# Altium project Coral Dev Board Micro.PrjPcb (part 4 of 5)

## Sheet 13 USB.SchDoc: Coral 6 Layer Template With Controlled Impedances
size A2; ApprovedBy: DNP; CheckedBy: DNP; Author: DNP; CompanyName: Google LLC; DrawnBy: DNP; Engineer: Stefan; Organization: Google LLC; Address1: 1600 Amphitheatre Parkway; Address2: Mountain View, CA 94043; Address3: DNP; Address4: DNP; DocumentNumber: 13; Revision: PVT; SheetNumber: 13; SheetTotal: 17; VersionControl_RevNumber: DNP; IsUserConfigurable: DNP; Time: DNP; ImagePath: DNP; Rule: DNP; ProjectName: Enterprise; Application_BuildNumber: DNP
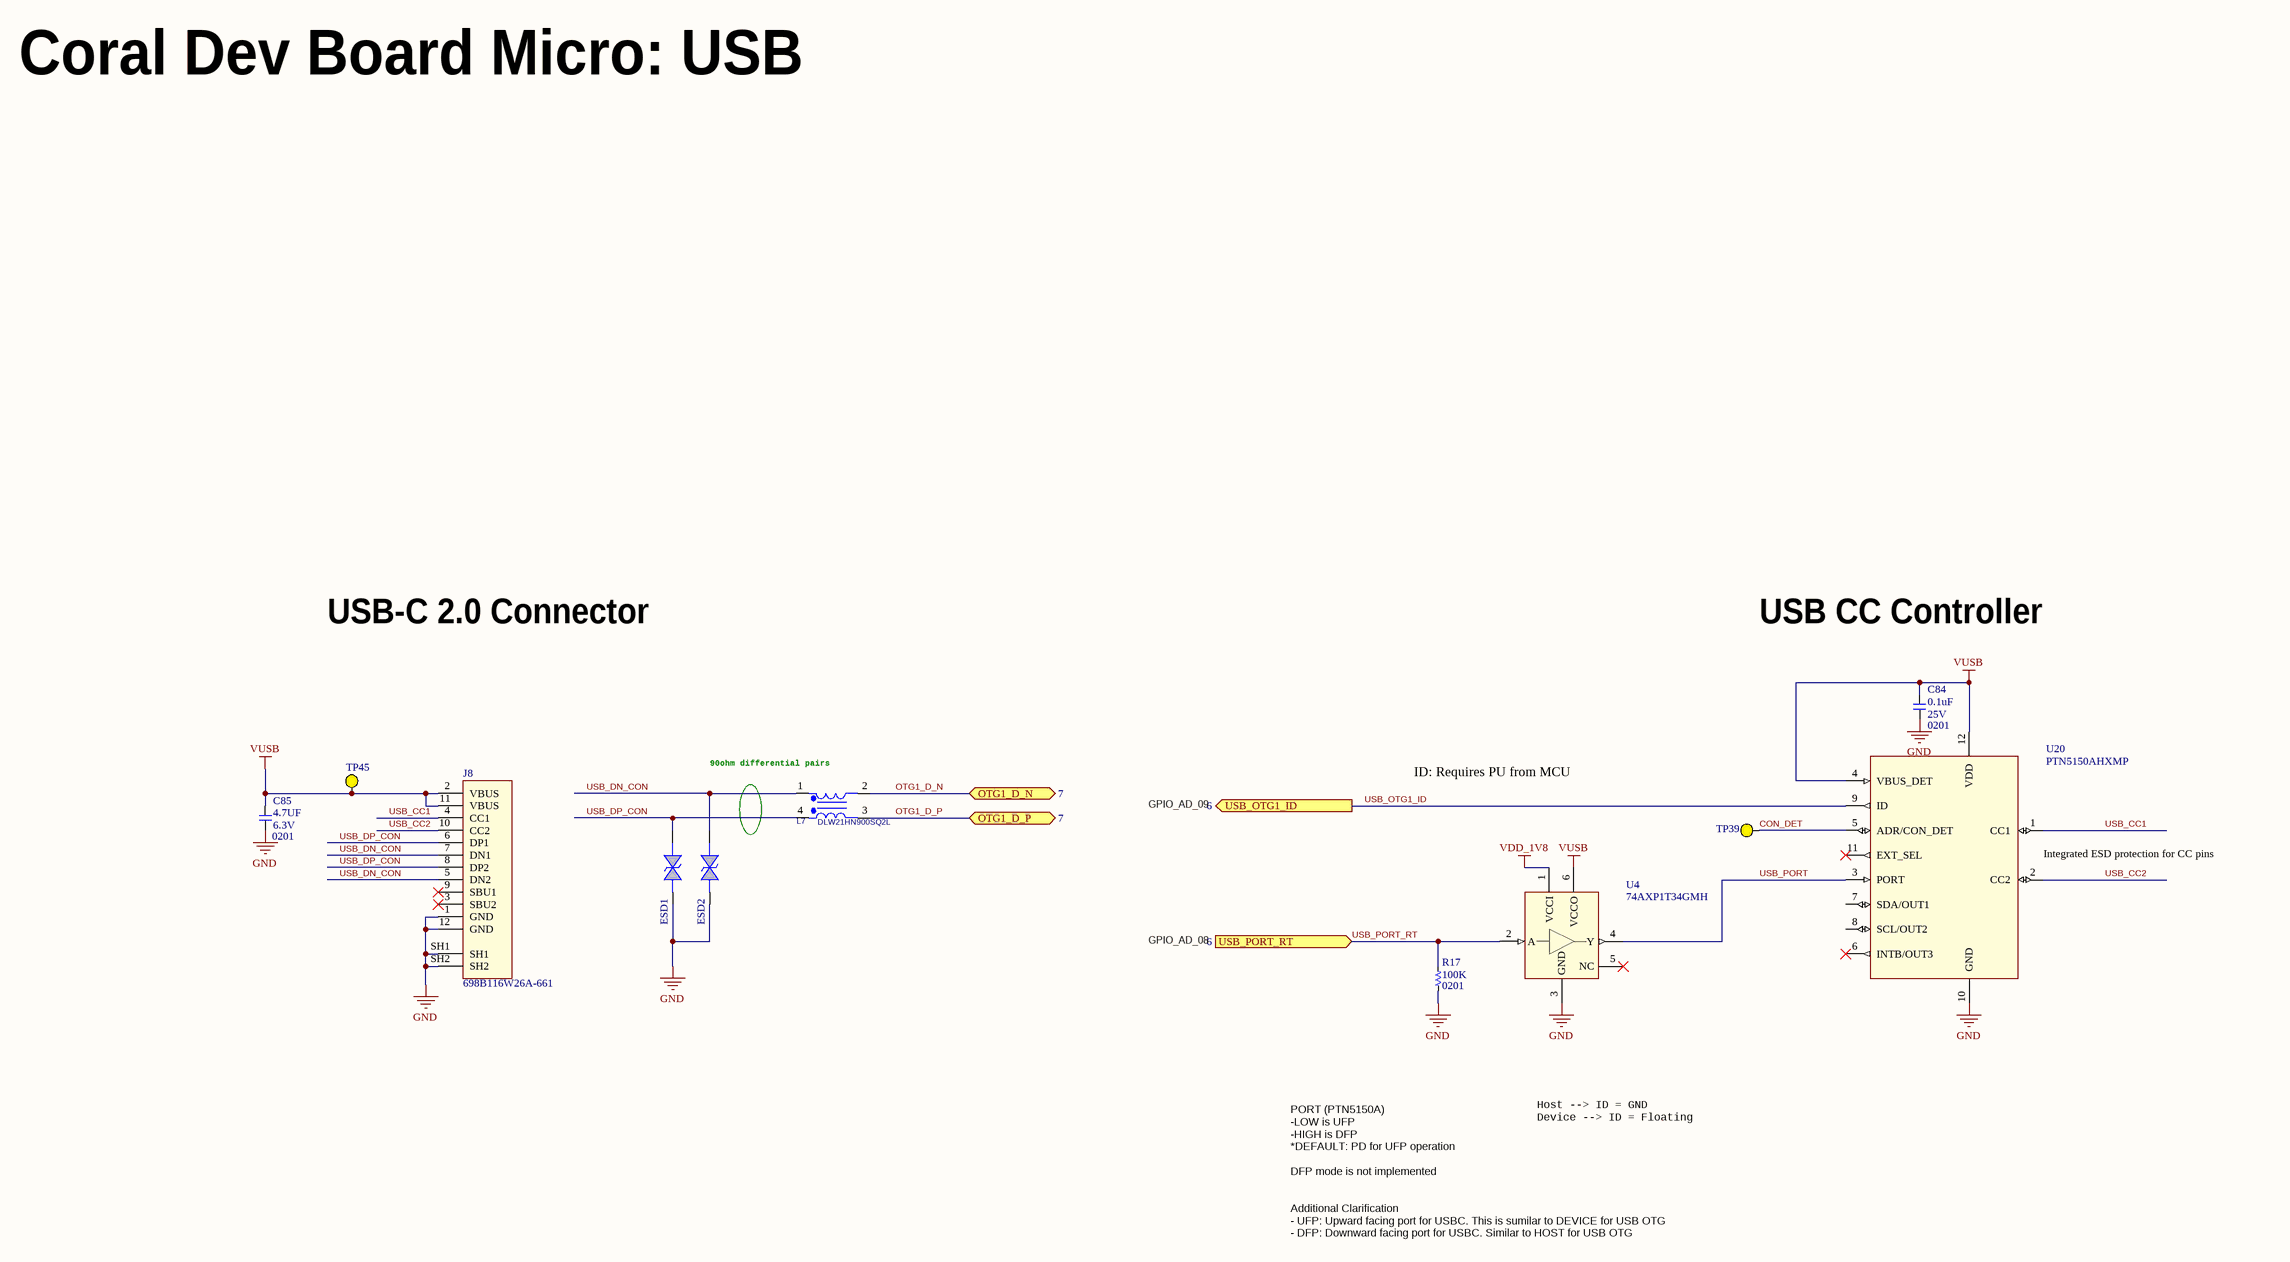
[diagram p18: 13 USB.SchDoc]

### Parts
C84  value 0.1uF  Package: 0201  Voltage: 25V  [C0201Y]  (hidden comment: __Template_Cap)
C85  value 4.7UF  Package: 0201  Voltage: 6.3V  [C0201Y]  (hidden comment: __Template_Cap)
ESD1  3.5pF/5V  [0201]  (value not drawn)
ESD2  3.5pF/5V  [0201]  (value not drawn)
J8  MFG P/N: 698B116W26A-661  [EDAC_698B116W26A-661]
L7  DLW21HN900SQ2L  [IND4_CHOKE_0805]
R17  value 100K  Package: 0201  [R0201]
TP39  TESTPAD_30MIL  [TESTPAD_SMT_30MIL]  (value not drawn)  (no BOM)
TP45  TESTPAD_30MIL  [TESTPAD_SMT_30MIL]  (value not drawn)  (no BOM)
U4  MFG P/N: 74AXP1T34GMH  [SON50P145X100X50-6]  (hidden comment: TRANSLATOR_74AXP1T34GMH)
U20  MFG P/N: PTN5150AHXMP  [X2QFN12_1.6X1.6MMM]  (hidden comment: CONTROLLER_PTN5150AHXMP)

### Ports
OTG1_D_N (bidir, see 7), OTG1_D_P (bidir, see 7), USB_OTG1_ID (out, see 6), USB_PORT_RT (in, see 6)

### Nets
GND: C84.2 C85.2 ESD1.1 ESD2.1 J8.1(GND) J8.12(GND) J8.SH1 J8.SH2 R17.1 U4.3(GND) U20.10(GND)
VDD_1V8: U4.1(VCCI)
VUSB: C84.1 C85.1 J8.2(VBUS) J8.11(VBUS) TP45.1 U4.6(VCCO) U20.4(VBUS_DET) U20.12(VDD)
CON_DET: TP39.1 U20.5(ADR/CON_DET)
OTG1_D_N: L7.2 ; port OTG1_D_N
OTG1_D_P: L7.3 ; port OTG1_D_P
USB_CC1: J8.4(CC1) U20.1(CC1)
USB_CC2: J8.10(CC2) U20.2(CC2)
USB_DN_CON: ESD2.2 J8.5(DN2) J8.7(DN1) L7.1
USB_DP_CON: ESD1.2 J8.6(DP1) J8.8(DP2) L7.4
USB_OTG1_ID: U20.9(ID) ; port USB_OTG1_ID
USB_PORT: U4.4(Y) U20.3(PORT)
USB_PORT_RT: R17.2 U4.2(A) ; port USB_PORT_RT

Not connected (* = marked no-connect by the designer): J8 3(SBU2)* 9(SBU1)*; U4 5(NC)*; U20 6(INTB/OUT3)* 7(SDA/OUT1) 8(SCL/OUT2) 11(EXT_SEL)*

### Notes on the sheet
- Coral Dev Board Micro: USB
- USB-C 2.0 Connector
- USB CC Controller
- (near L7) 90ohm differential pairs
- ID: Requires PU from MCU
- GPIO_AD_09
- (near U20) Integrated ESD protection for CC pins
- GPIO_AD_08
- Host --> ID = GND
  Device --> ID = Floating
- PORT (PTN5150A)
  -LOW is UFP
  -HIGH is DFP
  *DEFAULT: PD for UFP operation
  DFP mode is not implemented
- Additional Clarification
  - UFP: Upward facing port for USBC. This is sumilar to DEVICE for USB OTG
  - DFP: Downward facing port for USBC. Similar to HOST for USB OTG
- Project:
- Engineer:
- Date:
- File:
- Revision:
- Sheet
- of

### Library data of the parts
C84 = 386: as C19 on sheet 08 B2B; Status: Released; Dielectric: X5R; Tolerance: 20%; Height: 0.33mm T; ComponentLink1Description: Datasheet; COMMON: 150-01204-00; LOON: 150-01204-00; Gecko: 150-01204-00
C85 = 1199: as C235 on sheet 07 MIMXRT1170 PART3; Status: Released; Dielectric: X5R; Tolerance: 20%; Height: 0.33mm T; ComponentLink1Description: Datasheet; COMMON: 150-01224-00; LOON: 150-01224-00; Gecko: 150-01224-00
ESD1 ESD2 = DIODE BI-DIR TRIG: DIODE TVS 15kV 10V 50A 8pF SMT RoHS; MPN: DESD5V0V1BCSP-7; QPN: BC5V0V1BZ02; QPN Description: DIODE ESD SMD DESD5V0V1BCSP-7 6V,DSN0603; Function Code: USB; QCI MPN: DESD5V0V1BCSP-7; QCI Supplier: DDS
J8 = 1283: CONN, USB-C, RCPT, RA, USB 2.0, 16 P, 0.5MM PITCH, GOLD, SMT; ID: 1283; MFG: EDAC Inc; Number of Positions: 12; Current Rating: 3A; Voltage, Rated: 100VAC; Sub Assy Qty 2: 0; Status: Released; RoHS Compliant: Yes; Mounting Type: Surface Mount; Orientation: Right Angle; Number of Rows: 1; Operating Temperature: -30°C ~ 85°C; ComponentLink1Description: Datasheet; ComponentLink1URL: https://drive.google.com/corp/drive/folders/1cT-VNuTRhR0OJylJtjEkdbP9sP_ssI5q; Height: 2.71mm; Sub Assy Qty 3: 0; Sub Assy Qty 4: 0
L7 = IND_CMC_DLW21: IND CHK 90 OHM@100MHZ 330MA 25% 0805; QPN: CX1HN900000; QPN Description: EMI FILTER DLW21HN900SQ2L(90,330MA); Function Code: DBG; Supplier 1: Digi-Key; Supplier Part Number 1: 490-1064-1-ND; MPN: DLW21HN900SQ2L; QCI MPN: DLW21HN900SQ2L; QCI Supplier: MUR
R17 = 7818: RES, 100K, 1%, 1/20W, 0201; ID: 7818; MFG: PANASONIC; MFG P/N: ERJ1GEF1003C; COMMON: 470-00506-00; Status: NRND; Power: 1/20W; Tolerance: 1%; LOON: 470-00506-00; Gecko: 470-00506-00; XPN: 470-00506-00
TP39 TP45 = 178: as TP25 on sheet 07 MIMXRT1170 PART3; Status: Released; ComponentLink1URL: _PCB Feature
U4 = 441: IC, TRANSLATOR, 74AXP1, UNIDIR, 1-CH, NON-INVERTED O/P, LOW NOISE OVERSHOOT, XSON-6; ID: 441; MFG: Nexperia USA Inc.; Status: Released; Package: 6-XSON, SOT886 (1.45x1); Category: Integrated Circuits (ICs); RoHS Compliant: Yes; Supplier 1: Digi-Key; ComponentLink1Description: Datasheet; ComponentLink1URL: https://assets.nexperia.com/documents/data-sheet/74AXP1T34.pdf; Mounting Type: SMD; Height: 0.5mm; Supplier Part Number 1: 1727-2482-2-ND; HelpURL: https://www.digikey.com/en/products/detail/nexperia-usa-inc/74AXP1T34GMH/5971133?s=N4IgTCBcDaIOwBYCCANACgRgCoGYEHEBZACRAF0BfIA
U20 = 224: IC, HOST CTLR, PTN5150A, USB, 2.7 TO 5.5 VIN, X2QFN-12; ID: 224; MFG: NXP USA Inc.; Status: Released; Package: 12-X2QFN (1.6x1.6); RoHS Compliant: YES; Supplier 1: Digi-Key; HelpURL: https://www.digikey.in/product-detail/en/nxp-usa-inc/PTN5150AHXMP/568-13083-1-ND/6569882; ComponentLink1Description: Datasheet; ComponentLink1URL: https://www.nxp.com/docs/en/data-sheet/PTN5150A.pdf; Mounting Type: SMD; Supplier Part Number 1: 568-13083-1-ND

## Sheet 14 TPU.SchDoc: Coral 6 Layer Template With Controlled Impedances
size A2; ApprovedBy: DNP; CheckedBy: DNP; Author: DNP; CompanyName: Google LLC; DrawnBy: DNP; Engineer: Stefan; Organization: Google LLC; Address1: 1600 Amphitheatre Parkway; Address2: Mountain View, CA 94043; Address3: DNP; Address4: DNP; DocumentNumber: 14; Revision: PVT; SheetNumber: 14; SheetTotal: 17; VersionControl_RevNumber: DNP; IsUserConfigurable: DNP; Time: DNP; ImagePath: DNP; Rule: DNP; ProjectName: Enterprise; Application_BuildNumber: DNP
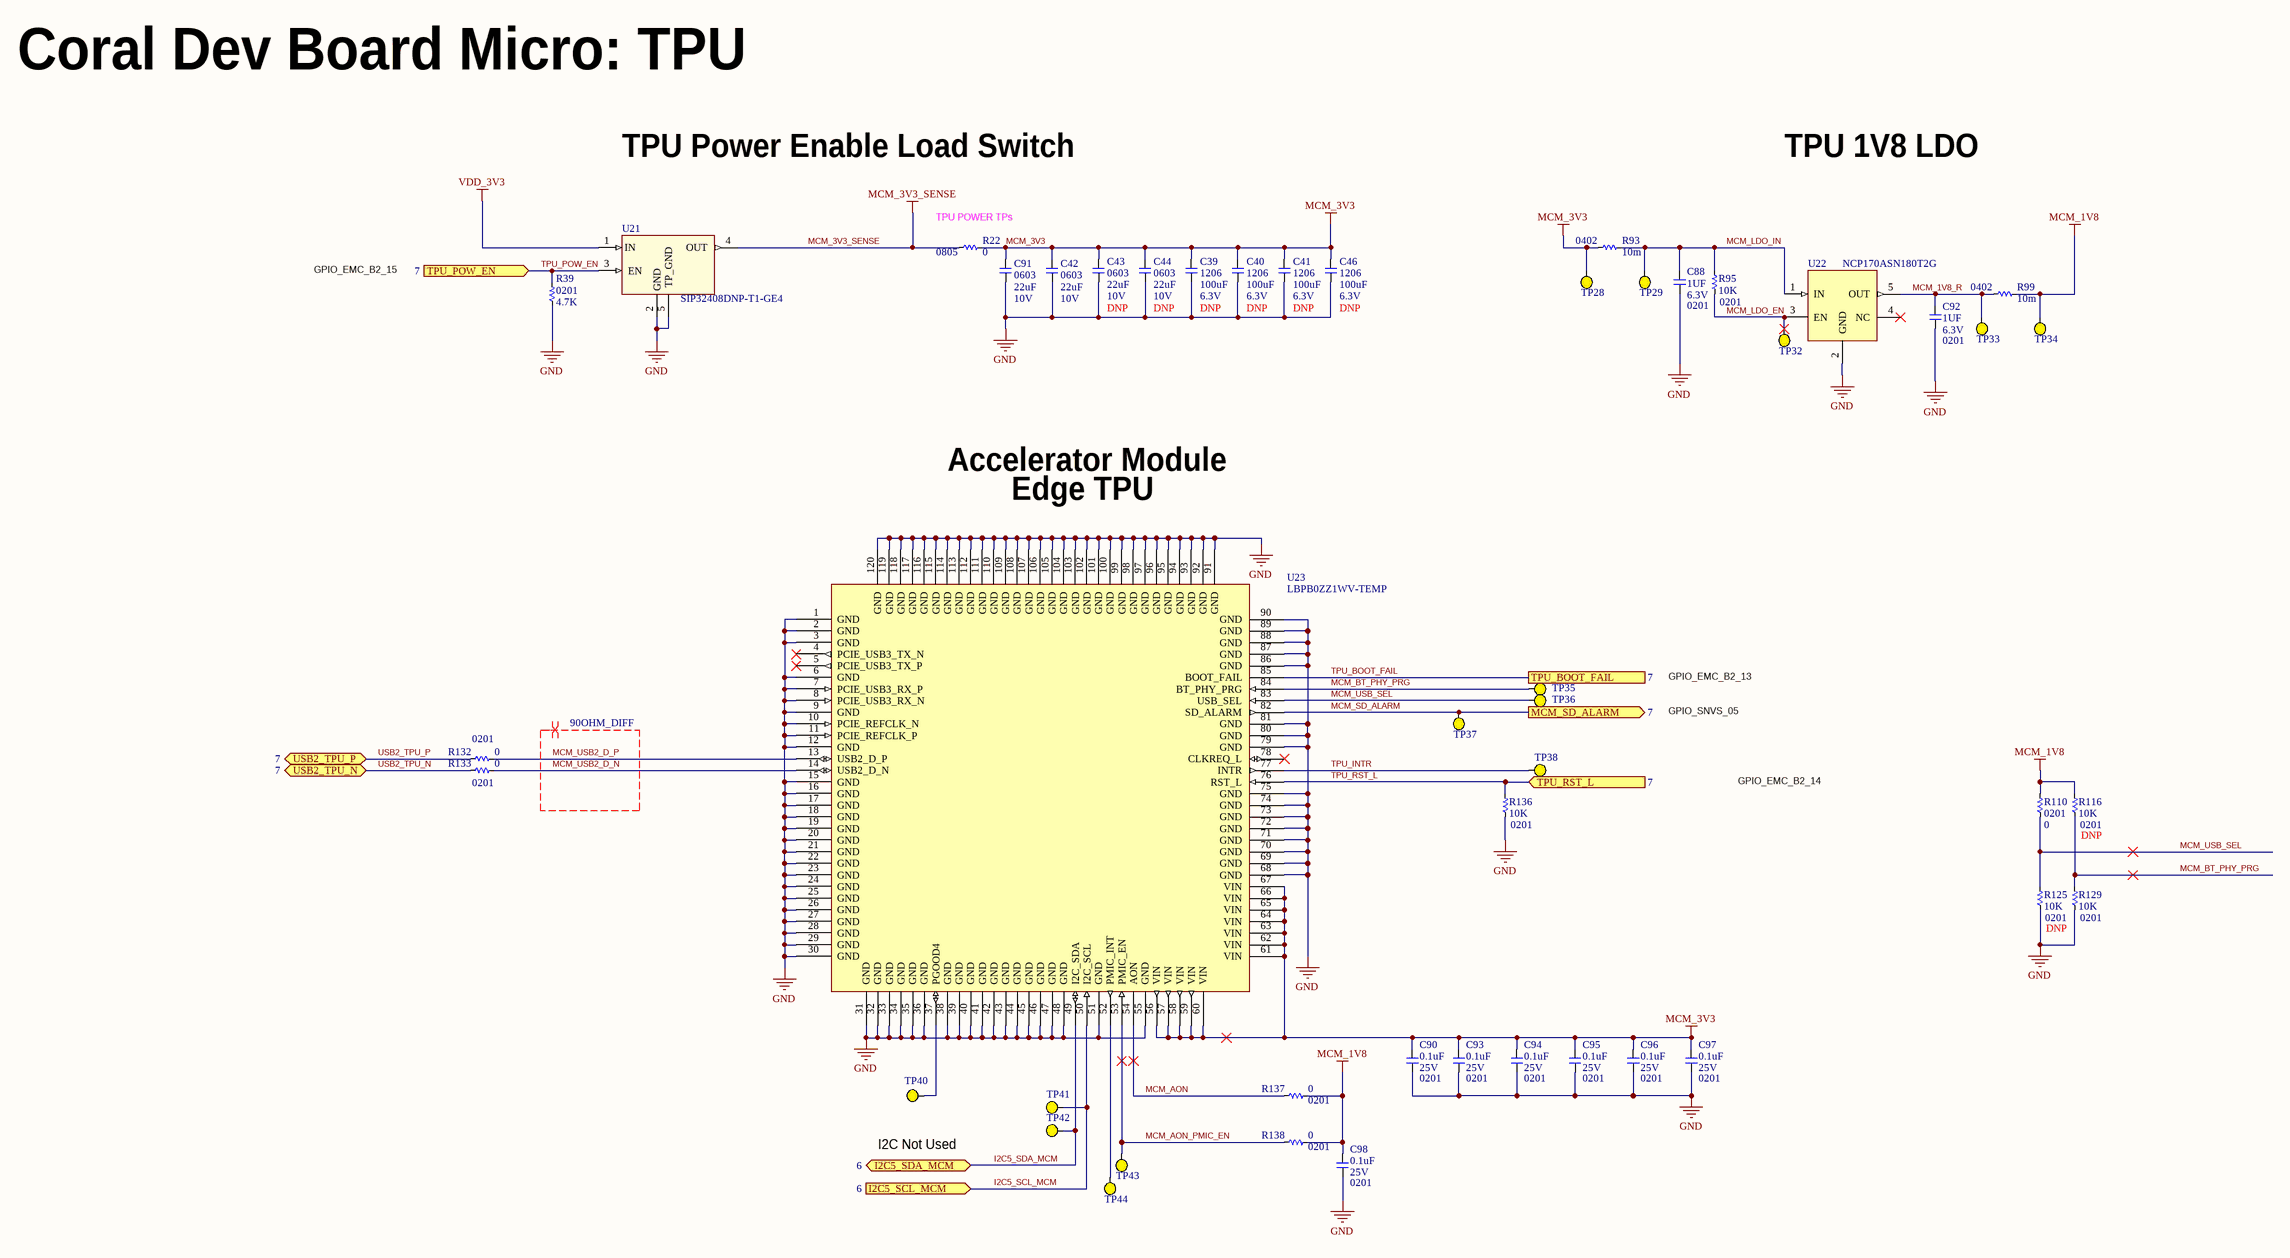
[diagram p19: 14 TPU.SchDoc]

### Parts
C39  value 100uF  Package: 1206  Voltage: 6.3V  [C1206Y_1.90MM]  (hidden comment: __Template_Cap)
C40  value 100uF  Package: 1206  Voltage: 6.3V  [C1206Y_1.90MM]  (hidden comment: __Template_Cap)
C41  value 100uF  Package: 1206  Voltage: 6.3V  [C1206Y_1.90MM]  (hidden comment: __Template_Cap)
C42  value 22uF  Package: 0603  Voltage: 10V  [C0603]  (hidden comment: __Template_Cap)
C43  value 22uF  Package: 0603  Voltage: 10V  [C0603]  (hidden comment: __Template_Cap)
C44  value 22uF  Package: 0603  Voltage: 10V  [C0603]  (hidden comment: __Template_Cap)
C46  value 100uF  Package: 1206  Voltage: 6.3V  [C1206Y_1.90MM]  (hidden comment: __Template_Cap)
C88  value 1UF  Package: 0201  Voltage: 6.3V  [C0201_H0.39MM]  (hidden comment: __Template_Cap)
C90  value 0.1uF  Package: 0201  Voltage: 25V  [C0201Y]  (hidden comment: __Template_Cap)
C91  value 22uF  Package: 0603  Voltage: 10V  [C0603]  (hidden comment: __Template_Cap)
C92  value 1UF  Package: 0201  Voltage: 6.3V  [C0201_H0.39MM]  (hidden comment: __Template_Cap)
C93  value 0.1uF  Package: 0201  Voltage: 25V  [C0201Y]  (hidden comment: __Template_Cap)
C94  value 0.1uF  Package: 0201  Voltage: 25V  [C0201Y]  (hidden comment: __Template_Cap)
C95  value 0.1uF  Package: 0201  Voltage: 25V  [C0201Y]  (hidden comment: __Template_Cap)
C96  value 0.1uF  Package: 0201  Voltage: 25V  [C0201Y]  (hidden comment: __Template_Cap)
C97  value 0.1uF  Package: 0201  Voltage: 25V  [C0201Y]  (hidden comment: __Template_Cap)
C98  value 0.1uF  Package: 0201  Voltage: 25V  [C0201Y]  (hidden comment: __Template_Cap)
R22  value 0  Package: 0805  [R0805]
R39  value 4.7K  Package: 0201  [R0201]
R93  value 10m  Package: 0402  [R0402]
R95  value 10K  Package: 0201  [R0201]
R99  value 10m  Package: 0402  [R0402]
R110  value 0  Package: 0201  [R0201]
R116  value 10K  Package: 0201  [R0201]
R125  value 10K  Package: 0201  [R0201]
R129  value 10K  Package: 0201  [R0201]
R132  value 0  Package: 0201  [R0201]
R133  value 0  Package: 0201  [R0201]
R136  value 10K  Package: 0201  [R0201]
R137  value 0  Package: 0201  [R0201]
R138  value 0  Package: 0201  [R0201]
TP28  TESTPAD_25MIL  [TESTPAD_SMT_25MIL]  (value not drawn)  (no BOM)
TP29  TESTPAD_25MIL  [TESTPAD_SMT_25MIL]  (value not drawn)  (no BOM)
TP32  TESTPAD_25MIL  [TESTPAD_SMT_25MIL]  (value not drawn)  (no BOM)
TP33  TESTPAD_25MIL  [TESTPAD_SMT_25MIL]  (value not drawn)  (no BOM)
TP34  TESTPAD_25MIL  [TESTPAD_SMT_25MIL]  (value not drawn)  (no BOM)
TP35  TESTPAD_25MIL  [TESTPAD_SMT_25MIL]  (value not drawn)  (no BOM)
TP36  TESTPAD_25MIL  [TESTPAD_SMT_25MIL]  (value not drawn)  (no BOM)
TP37  TESTPAD_25MIL  [TESTPAD_SMT_25MIL]  (value not drawn)  (no BOM)
TP38  TESTPAD_25MIL  [TESTPAD_SMT_25MIL]  (value not drawn)  (no BOM)
TP40  TESTPAD_25MIL  [TESTPAD_SMT_25MIL]  (value not drawn)  (no BOM)
TP41  TESTPAD_25MIL  [TESTPAD_SMT_25MIL]  (value not drawn)  (no BOM)
TP42  TESTPAD_25MIL  [TESTPAD_SMT_25MIL]  (value not drawn)  (no BOM)
TP43  TESTPAD_25MIL  [TESTPAD_SMT_25MIL]  (value not drawn)  (no BOM)
TP44  TESTPAD_25MIL  [TESTPAD_SMT_25MIL]  (value not drawn)  (no BOM)
U21  MFG P/N: SIP32408DNP-T1-GE4  [TDFN120X160X60-4-TP]  (hidden comment: SWITCH_SIP32408DNP-T1-GE4)
U22  MFG P/N: NCP170ASN180T2G  [TSOP95P275X110-5]  (hidden comment: LDO_NCP170ASN180T2G)
U23  LBPB0ZZ1WV-TEMP  [QFN120_0P5_10X15]

### Ports
I2C5_SCL_MCM (in, see 6), I2C5_SDA_MCM (bidir, see 6), MCM_SD_ALARM (out, see 7), TPU_BOOT_FAIL (see 7), TPU_POW_EN (in, see 7), TPU_RST_L (in, see 7), USB2_TPU_N (bidir, see 7), USB2_TPU_P (bidir, see 7)

### Nets
GND: C39.2 C40.2 C41.2 C42.2 C43.2 C44.2 C46.2 C88.2 C90.2 C91.2 C92.2 C93.2 C94.2 C95.2 C96.2 C97.2 C98.2 R39.1 R125.1 R129.1 R136.1 U21.2(GND) U21.5(TP_GND) U22.2(GND) U23.1(GND) U23.2(GND) U23.3(GND) U23.6(GND) U23.7(PCIE_USB3_RX_P) U23.8(PCIE_USB3_RX_N) U23.9(GND) U23.10(PCIE_REFCLK_N) U23.11(PCIE_REFCLK_P) U23.12(GND) U23.15(GND) U23.16(GND) U23.17(GND) U23.18(GND) U23.19(GND) U23.20(GND) U23.21(GND) U23.22(GND) U23.23(GND) U23.24(GND) U23.25(GND) U23.26(GND) U23.27(GND) U23.28(GND) U23.29(GND) U23.30(GND) U23.31(GND) U23.32(GND) U23.33(GND) U23.34(GND) U23.35(GND) U23.36(GND) U23.38(GND) U23.39(GND) U23.40(GND) U23.41(GND) U23.42(GND) U23.43(GND) U23.44(GND) U23.45(GND) U23.46(GND) U23.47(GND) U23.48(GND) U23.51(GND) U23.55(GND) U23.68(GND) U23.69(GND) U23.70(GND) U23.71(GND) U23.72(GND) U23.73(GND) U23.74(GND) U23.75(GND) U23.79(GND) U23.80(GND) U23.81(GND) U23.86(GND) U23.87(GND) U23.88(GND) U23.89(GND) U23.90(GND) U23.91(GND) U23.92(GND) U23.93(GND) U23.94(GND) U23.95(GND) U23.96(GND) U23.97(GND) U23.98(GND) U23.99(GND) U23.100(GND) U23.101(GND) U23.102(GND) U23.103(GND) U23.104(GND) U23.105(GND) U23.106(GND) U23.107(GND) U23.108(GND) U23.109(GND) U23.110(GND) U23.111(GND) U23.112(GND) U23.113(GND) U23.114(GND) U23.115(GND) U23.116(GND) U23.117(GND) U23.118(GND) U23.119(GND) U23.120(GND)
MCM_1V8: C98.1 R99.2 R110.2 R116.2 R137.2 R138.2 TP34.1
MCM_3V3: C39.1 C40.1 C41.1 C42.1 C43.1 C44.1 C46.1 C90.1 C91.1 C93.1 C94.1 C95.1 C96.1 C97.1 R22.2 R93.1 TP28.1 U23.56(VIN) U23.57(VIN) U23.58(VIN) U23.59(VIN) U23.60(VIN) U23.61(VIN) U23.62(VIN) U23.63(VIN) U23.64(VIN) U23.65(VIN) U23.66(VIN) U23.67(VIN)
MCM_3V3_SENSE: R22.1 U21.4(OUT)
VDD_3V3: U21.1(IN)
I2C5_SCL_MCM: TP41.1 U23.50(I2C_SCL) ; port I2C5_SCL_MCM
I2C5_SDA_MCM: TP42.1 U23.49(I2C_SDA) ; port I2C5_SDA_MCM
MCM_1V8_R: C92.1 R99.1 TP33.1 U22.5(OUT)
MCM_AON: R137.1 U23.54(AON)
MCM_AON_PMIC_EN: R138.1 TP43.1 U23.53(PMIC_EN)
MCM_BT_PHY_PRG: R116.1 R129.2 TP35.1 U23.84(BT_PHY_PRG)
MCM_LDO_EN: R95.1 TP32.1 U22.3(EN)
MCM_LDO_IN: C88.1 R93.2 R95.2 TP29.1 U22.1(IN)
MCM_SD_ALARM: TP37.1 U23.82(SD_ALARM) ; port MCM_SD_ALARM
MCM_USB2_D_N: R133.2 U23.14(USB2_D_N)
MCM_USB2_D_P: R132.2 U23.13(USB2_D_P)
MCM_USB_SEL: R110.1 R125.2 TP36.1 U23.83(USB_SEL)
TPU_BOOT_FAIL: U23.85(BOOT_FAIL) ; port TPU_BOOT_FAIL
TPU_INTR: TP38.1 U23.77(INTR)
TPU_POW_EN: R39.2 U21.3(EN) ; port TPU_POW_EN
TPU_RST_L: R136.2 U23.76(RST_L) ; port TPU_RST_L
USB2_TPU_N: R133.1 ; port USB2_TPU_N
USB2_TPU_P: R132.1 ; port USB2_TPU_P
NetTP40_1: TP40.1 U23.37(PGOOD4)
NetTP44_1: TP44.1 U23.52(PMIC_INT)

Not connected (* = marked no-connect by the designer): U22 4(NC)*; U23 4(PCIE_USB3_TX_N)* 5(PCIE_USB3_TX_P)* 78(CLKREQ_L)*

### Layout directives
differential pair; differential pair class 90OHM_DIFF: MCM_USB2_D_N, MCM_USB2_D_P

### Notes on the sheet
- Coral Dev Board Micro: TPU
- TPU Power Enable Load Switch
- TPU 1V8 LDO
- GPIO_EMC_B2_15
- (near R22) TPU POWER TPs
- Accelerator Module
- Edge TPU
- GPIO_EMC_B2_13
- GPIO_SNVS_05
- GPIO_EMC_B2_14
- (near TP40) I2C Not Used
- Project:
- Engineer:
- Date:
- File:
- Revision:
- Sheet
- of

### Library data of the parts
C39-C41 C46 = 1051: CAP, CER, X5R, 100UF, 6.3V, 20%, 1206; ID: 1051; MFG: MURATA; MFG P/N: GRM31CR60J107ME39L; XPN: 150-00520-00; PROXY: 150-04679-00; Status: Obsolete; Dielectric: X5R; Tolerance: 20%; Height: 1.9mm T; ComponentLink1Description: Datasheet; COMMON: 150-00520-00; DNP: DNP
C42 C91 = 108: CAP, CER, X5R, 22uF, 20%, 10V, 0603; ID: 108; MFG: TDK; MFG P/N: C1608X5R1A226M080AC; XPN: 150-00202-00; PROXY: Use ID #452; Status: Released; Dielectric: X5R; Tolerance: 20%; Height: 1mm; ComponentLink1Description: Datasheet; COMMON: 150-00202-00
C43 C44 = 392: CAP, CER, X5R, 22uF, 20%, 10V, 0603; ID: 392; MFG: SAMSUNG; MFG P/N: CL10A226MP8NUNE; XPN: 150-00202-00; PROXY: Use ID #452; Status: Released; Dielectric: X5R; Tolerance: 20%; Height: 0.9mm T; ComponentLink1Description: Datasheet; COMMON: 150-00202-00; DNP: DNP
C88 C92 = 1771: as C119 on sheet 07 MIMXRT1170 PART3; Status: In Development; Dielectric: X6S; Tolerance: 20%; Height: 0.39mm; Supplier 1: Digi-Key; HelpURL: https://www.digikey.com/product-detail/en/murata-electronics-north-america/GRM033C80J105ME05D/490-13218-1-ND/5877426; ComponentLink1Description: Datasheet; ComponentLink1URL: https://psearch.en.murata.com/capacitor/product/GRM033C80J105ME05%23.pdf; Supplier Part Number 1: 490-13218-1-ND
C90 C93-C98 = 386: as C19 on sheet 08 B2B; Status: Released; Dielectric: X5R; Tolerance: 20%; Height: 0.33mm T; ComponentLink1Description: Datasheet; COMMON: 150-01204-00; LOON: 150-01204-00; Gecko: 150-01204-00
R22 = 7564: RES, 0, JUMPER, 1/8W, 0805; ID: 7564; MFG: YAGEO; MFG P/N: RC0805JR-070RL; Tolerance: 5%; COMMON: 470-00435-00; Gecko: 470-17928-00; Status: Released; Power: 1/8W; LOON: 470-00435-00; XPN: 470-00435-00
R39 = 6602: as R90 on sheet 11 SDRAM; Status: Released; Power: 1/20W; Tolerance: 5%; LOON: 470-00012-00; Gecko: 470-00012-00; XPN: 470-00012-00
R93 R99 = 7159: RES, 0.01, 5%, 1/4W, 0402; ID: 7159; MFG: YAGEO; MFG P/N: PE0402JRF470R01L; COMMON: 470-02385-00; Status: Released; Power: 1/4W; Tolerance: 5%; LOON: 470-02385-00; Gecko: 470-02385-00; XPN: 470-02385-00
R95 R116 R125 R129 R136 = 4151: as R72 on sheet 10 FLASH_BOOT; Status: Released; Power: 1/20W; Tolerance: 1%; Height: 0.26mm; Supplier 1: Digi-Key; LOON: 470-00033-00; Gecko: 470-00033-00; XPN: 470-00033-00; Supplier Part Number 1: 311-10.0KMCT-ND
  R116 R125: DNP: DNP
R110 R132 R133 R137 R138 = 8315: as R1848 on sheet 07 MIMXRT1170 PART3; Status: Released; Power: 1/20W; LOON: 470-00013-00; Gecko: 470-00013-00; XPN: 470-00013-00
TP28 TP29 TP32-TP38 TP40-TP44 = 115: TESTPAD_SMT_25MIL; ID: 115; MFG: _PCB Feature; Status: In Development; ComponentLink1URL: _PCB Feature
U21 = 926: IC, SW, SIP32408, HIGH-SIDE, N-CH, 1:1, 1.1V TO 5.5V VCL, 3.5A, 44mOHM RDS(ON), TDFN-4; ID: 926; MFG: Vishay Siliconix; Status: Released; Package: 4-TDFN (1.2x1.6); Category: Integrated Circuits (ICs); RoHS Compliant: Yes; Supplier 1: Digi-Key; HelpURL: https://www.digikey.com/en/products/detail/vishay-siliconix/SIP32408DNP-T1-GE4/4496331?s=N4IgTCBcDaIAQGUCSAFAzGALABgBwBEA5FAWgBUBGEgcQFFMQBdAXyA; ComponentLink1Description: Datasheet; ComponentLink1URL: https://www.vishay.com/docs/63717/sip32408.pdf; Mounting Type: SMD; Height: 0.6mm; Supplier Part Number 1: SIP32408DNP-T1-GE4TR-ND
U22 = 930: IC, REG, NCP170AS, LINEAR, FIXED, 2.2V TO 5.5V VIN, 1.8V VOUT, 150mA, TSOP-5; ID: 930; MFG: onsemi; Status: Released; Package: 5-TSOP; Category: Integrated Circuits (ICs); RoHS Compliant: Yes; Supplier 1: Digi-Key; HelpURL: https://www.digikey.com/en/products/detail/onsemi/NCP170ASN180T2G/9829222?s=N4IgTCBcDaIHIGEAKBGA7ABgIIGU4oA4MAVMAcRAF0BfIA; ComponentLink1Description: Datasheet; ComponentLink1URL: https://www.onsemi.com/pdf/datasheet/ncp170-d.pdf; Mounting Type: SMD; Height: 1.1mm; Supplier Part Number 1: NCP170ASN180T2GOSTR-ND
U23 = LBPB0ZZ1WV-TEMP: TPU module